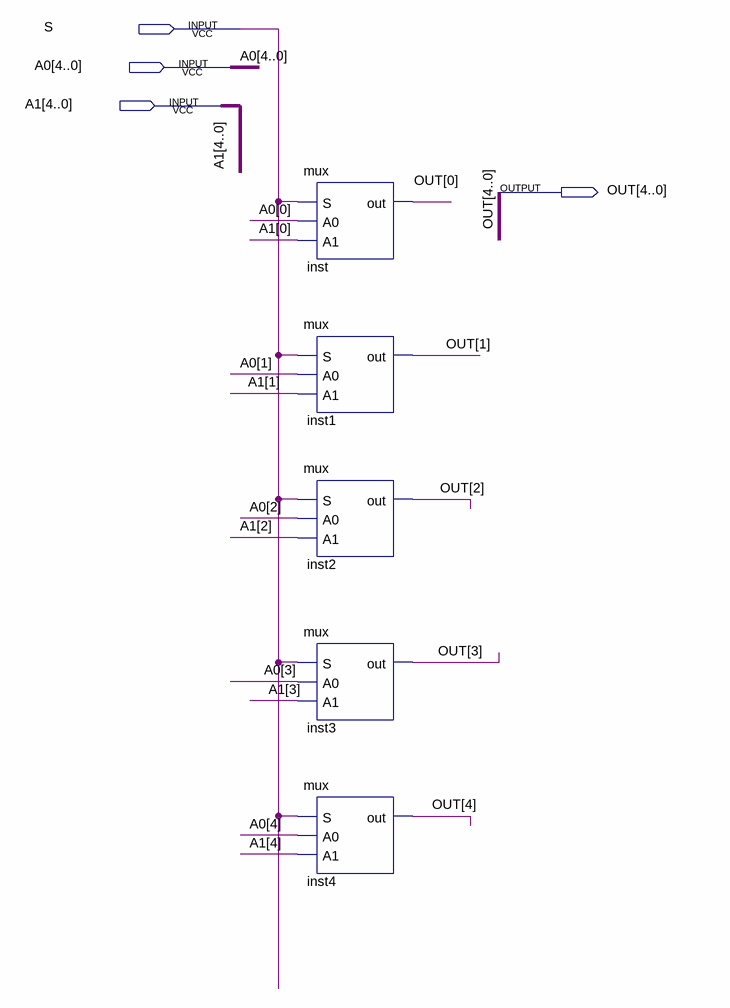
[diagram p0: schematic sheet]
// Quartus schematic SELECT.bdf as structural Verilog: 5 symbols, 4 pins
module SELECT (
  input  S,
  input  [4:0] A0,
  input  [4:0] A1,
  output [4:0] OUT
);

  mux inst (.S(S), .A0(A0[0]), .A1(A1[0]), .out(OUT[0]));
  mux inst1 (.S(S), .A0(A0[1]), .A1(A1[1]), .out(OUT[1]));
  mux inst2 (.S(S), .A0(A0[2]), .A1(A1[2]), .out(OUT[2]));
  mux inst3 (.S(S), .A0(A0[3]), .A1(A1[3]), .out(OUT[3]));
  mux inst4 (.S(S), .A0(A0[4]), .A1(A1[4]), .out(OUT[4]));
endmodule
